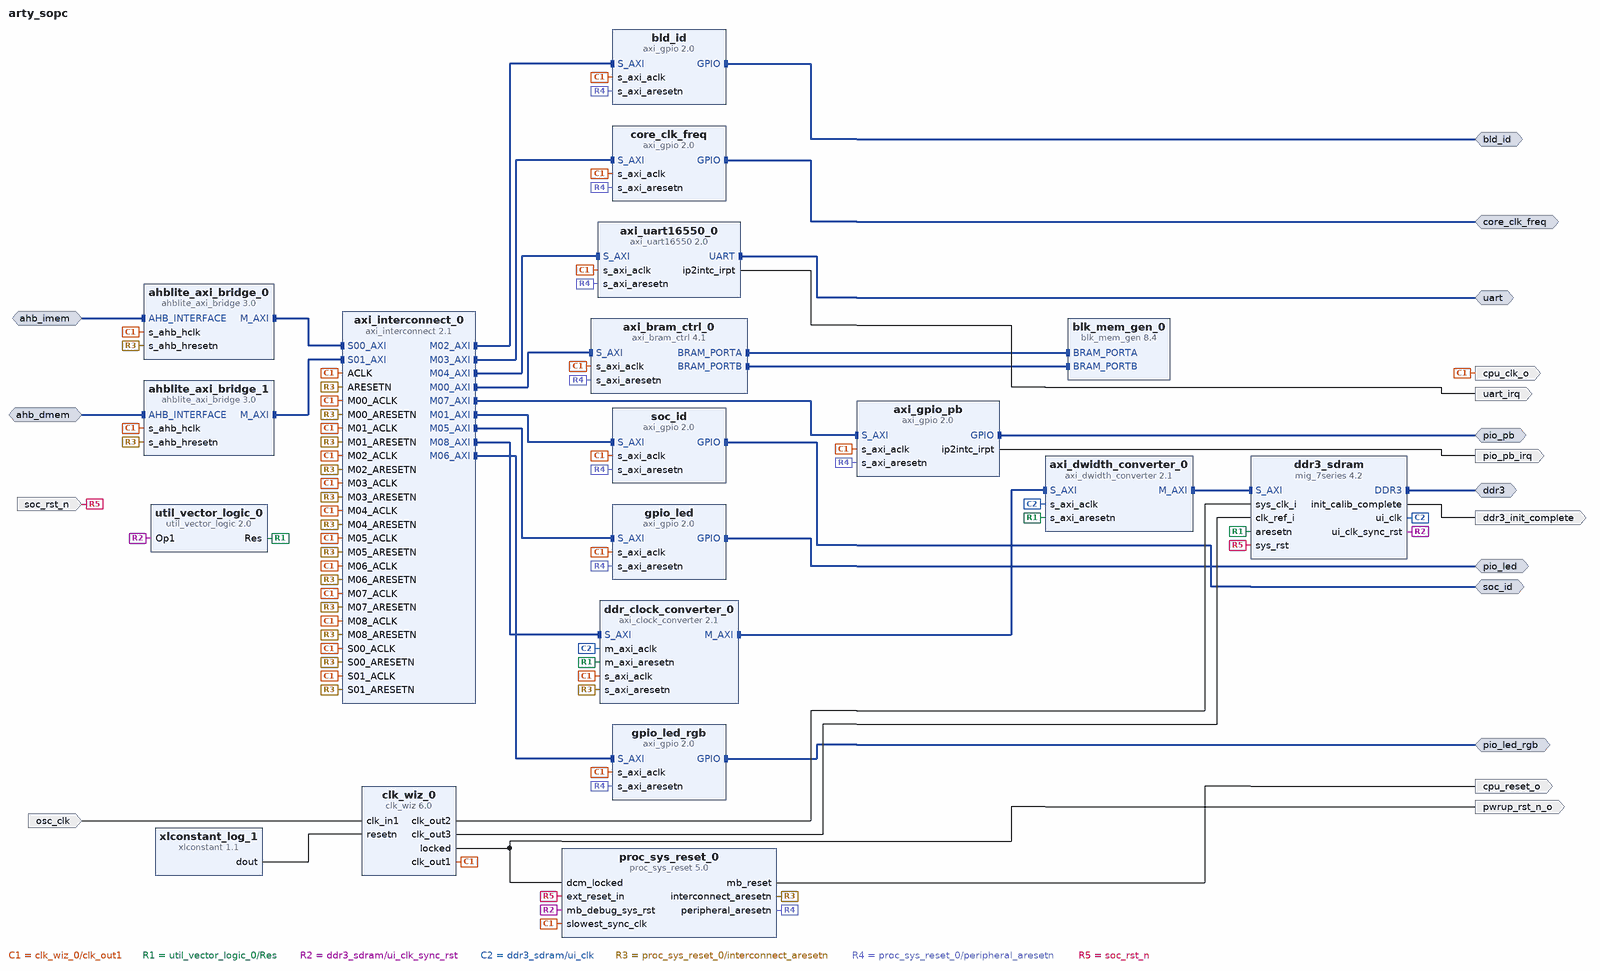
[diagram p0: block diagram of the top level]
# Vivado block design arty_sopc, xc7a100tcsg324-1, Vivado 2022.2
create_bd_design arty_sopc

create_bd_intf_port -mode Slave -vlnv xilinx.com:interface:ahblite_rtl:2.0 ahb_dmem
create_bd_intf_port -mode Slave -vlnv xilinx.com:interface:ahblite_rtl:2.0 ahb_imem
create_bd_intf_port -mode Master -vlnv xilinx.com:interface:gpio_rtl:1.0 bld_id
create_bd_intf_port -mode Master -vlnv xilinx.com:interface:gpio_rtl:1.0 core_clk_freq
create_bd_intf_port -mode Master -vlnv xilinx.com:interface:gpio_rtl:1.0 pio_led
create_bd_intf_port -mode Master -vlnv xilinx.com:interface:gpio_rtl:1.0 pio_led_rgb
create_bd_intf_port -mode Master -vlnv xilinx.com:interface:gpio_rtl:1.0 pio_pb
create_bd_intf_port -mode Master -vlnv xilinx.com:interface:ddrx_rtl:1.0 ddr3
create_bd_intf_port -mode Master -vlnv xilinx.com:interface:gpio_rtl:1.0 soc_id
create_bd_intf_port -mode Master -vlnv xilinx.com:interface:uart_rtl:1.0 uart
create_bd_port -dir O -type clk cpu_clk_o
create_bd_port -dir O -type rst cpu_reset_o
create_bd_port -dir O ddr3_init_complete
create_bd_port -dir I -type clk osc_clk
create_bd_port -dir O -type intr pio_pb_irq
create_bd_port -dir O -type rst pwrup_rst_n_o
create_bd_port -dir I -type rst soc_rst_n
create_bd_port -dir O -type intr uart_irq

create_bd_cell -type ip -vlnv xilinx.com:ip:ahblite_axi_bridge:3.0 ahblite_axi_bridge_0
set_property -dict {CONFIG.C_AHB_AXI_TIMEOUT 256} [get_bd_cells ahblite_axi_bridge_0]
create_bd_cell -type ip -vlnv xilinx.com:ip:ahblite_axi_bridge:3.0 ahblite_axi_bridge_1
set_property -dict {CONFIG.C_AHB_AXI_TIMEOUT 256 CONFIG.C_M_AXI_SUPPORTS_NARROW_BURST 1} [get_bd_cells ahblite_axi_bridge_1]
create_bd_cell -type ip -vlnv xilinx.com:ip:axi_bram_ctrl:4.1 axi_bram_ctrl_0
set_property -dict {CONFIG.PROTOCOL AXI4LITE CONFIG.SINGLE_PORT_BRAM 0} [get_bd_cells axi_bram_ctrl_0]
create_bd_cell -type ip -vlnv xilinx.com:ip:axi_dwidth_converter:2.1 axi_dwidth_converter_0
create_bd_cell -type ip -vlnv xilinx.com:ip:axi_gpio:2.0 axi_gpio_pb
set_property -dict [list \
  CONFIG.C_ALL_INPUTS 1 \
  CONFIG.C_GPIO_WIDTH 4 \
  CONFIG.C_INTERRUPT_PRESENT 1 \
  CONFIG.GPIO_BOARD_INTERFACE Custom \
] [get_bd_cells axi_gpio_pb]
create_bd_cell -type ip -vlnv xilinx.com:ip:axi_interconnect:2.1 axi_interconnect_0
set_property -dict [list \
  CONFIG.NUM_MI 9 \
  CONFIG.NUM_SI 2 \
  CONFIG.STRATEGY 1 \
  CONFIG.SYNCHRONIZATION_STAGES 2 \
] [get_bd_cells axi_interconnect_0]
create_bd_cell -type ip -vlnv xilinx.com:ip:axi_uart16550:2.0 axi_uart16550_0
set_property -dict {CONFIG.C_S_AXI_ACLK_FREQ_HZ 25000000} [get_bd_cells axi_uart16550_0]
create_bd_cell -type ip -vlnv xilinx.com:ip:axi_gpio:2.0 bld_id
set_property -dict {CONFIG.C_ALL_INPUTS 1 CONFIG.C_IS_DUAL 0} [get_bd_cells bld_id]
create_bd_cell -type ip -vlnv xilinx.com:ip:blk_mem_gen:8.4 blk_mem_gen_0
set_property -dict [list \
  CONFIG.EN_SAFETY_CKT false \
  CONFIG.Enable_B Use_ENB_Pin \
  CONFIG.Memory_Type True_Dual_Port_RAM \
  CONFIG.Port_B_Clock 100 \
  CONFIG.Port_B_Enable_Rate 100 \
  CONFIG.Port_B_Write_Rate 50 \
  CONFIG.Use_RSTB_Pin true \
] [get_bd_cells blk_mem_gen_0]
create_bd_cell -type ip -vlnv xilinx.com:ip:clk_wiz:6.0 clk_wiz_0
set_property -dict [list \
  CONFIG.CLKOUT1_JITTER 181.828 \
  CONFIG.CLKOUT1_PHASE_ERROR 104.359 \
  CONFIG.CLKOUT1_REQUESTED_OUT_FREQ 25.000 \
  CONFIG.CLKOUT2_REQUESTED_OUT_FREQ 166.667 \
  CONFIG.CLKOUT2_USED true \
  CONFIG.CLKOUT3_REQUESTED_OUT_FREQ 200.000 \
  CONFIG.CLKOUT3_USED true \
  CONFIG.ENABLE_CLOCK_MONITOR false \
  CONFIG.MMCM_DIVCLK_DIVIDE 1 \
  CONFIG.NUM_OUT_CLKS 3 \
  CONFIG.PRIMITIVE MMCM \
  CONFIG.RESET_PORT resetn \
  CONFIG.RESET_TYPE ACTIVE_LOW \
  CONFIG.USE_LOCKED true \
  CONFIG.USE_RESET true \
] [get_bd_cells clk_wiz_0]
create_bd_cell -type ip -vlnv xilinx.com:ip:axi_gpio:2.0 core_clk_freq
set_property -dict {CONFIG.C_ALL_INPUTS 1 CONFIG.C_IS_DUAL 0} [get_bd_cells core_clk_freq]
create_bd_cell -type ip -vlnv xilinx.com:ip:mig_7series:4.2 ddr3_sdram
set_property -dict {CONFIG.BOARD_MIG_PARAM ddr3_sdram} [get_bd_cells ddr3_sdram]
create_bd_cell -type ip -vlnv xilinx.com:ip:axi_clock_converter:2.1 ddr_clock_converter_0
create_bd_cell -type ip -vlnv xilinx.com:ip:axi_gpio:2.0 gpio_led
set_property -dict {CONFIG.C_ALL_OUTPUTS 1 CONFIG.C_GPIO_WIDTH 2 CONFIG.C_IS_DUAL 0} [get_bd_cells gpio_led]
create_bd_cell -type ip -vlnv xilinx.com:ip:axi_gpio:2.0 gpio_led_rgb
set_property -dict {CONFIG.C_ALL_OUTPUTS 1 CONFIG.C_GPIO_WIDTH 12} [get_bd_cells gpio_led_rgb]
create_bd_cell -type ip -vlnv xilinx.com:ip:proc_sys_reset:5.0 proc_sys_reset_0
create_bd_cell -type ip -vlnv xilinx.com:ip:axi_gpio:2.0 soc_id
set_property -dict {CONFIG.C_ALL_INPUTS 1 CONFIG.C_IS_DUAL 0} [get_bd_cells soc_id]
create_bd_cell -type ip -vlnv xilinx.com:ip:util_vector_logic:2.0 util_vector_logic_0
set_property -dict {CONFIG.C_OPERATION not CONFIG.C_SIZE 1} [get_bd_cells util_vector_logic_0]
create_bd_cell -type ip -vlnv xilinx.com:ip:xlconstant:1.1 xlconstant_log_1

# ---- connections ----

connect_bd_intf_net [get_bd_intf_ports ahb_imem] [get_bd_intf_pins ahblite_axi_bridge_0/AHB_INTERFACE]
connect_bd_intf_net [get_bd_intf_ports ahb_dmem] [get_bd_intf_pins ahblite_axi_bridge_1/AHB_INTERFACE]
connect_bd_intf_net [get_bd_intf_pins ahblite_axi_bridge_0/M_AXI] [get_bd_intf_pins axi_interconnect_0/S00_AXI]
connect_bd_intf_net [get_bd_intf_pins ahblite_axi_bridge_1/M_AXI] [get_bd_intf_pins axi_interconnect_0/S01_AXI]
connect_bd_intf_net [get_bd_intf_pins axi_bram_ctrl_0/BRAM_PORTA] [get_bd_intf_pins blk_mem_gen_0/BRAM_PORTA]
connect_bd_intf_net [get_bd_intf_pins axi_bram_ctrl_0/BRAM_PORTB] [get_bd_intf_pins blk_mem_gen_0/BRAM_PORTB]
connect_bd_intf_net [get_bd_intf_pins axi_dwidth_converter_0/M_AXI] [get_bd_intf_pins ddr3_sdram/S_AXI]
connect_bd_intf_net -intf_net axi_gpio_0_GPIO [get_bd_intf_ports soc_id] [get_bd_intf_pins soc_id/GPIO]
connect_bd_intf_net -intf_net axi_gpio_2_GPIO [get_bd_intf_ports pio_pb] [get_bd_intf_pins axi_gpio_pb/GPIO]
connect_bd_intf_net -intf_net axi_gpio_brd_sclkl_GPIO [get_bd_intf_ports core_clk_freq] [get_bd_intf_pins core_clk_freq/GPIO]
connect_bd_intf_net [get_bd_intf_pins axi_bram_ctrl_0/S_AXI] [get_bd_intf_pins axi_interconnect_0/M00_AXI]
connect_bd_intf_net [get_bd_intf_pins axi_interconnect_0/M01_AXI] [get_bd_intf_pins soc_id/S_AXI]
connect_bd_intf_net [get_bd_intf_pins axi_interconnect_0/M02_AXI] [get_bd_intf_pins bld_id/S_AXI]
connect_bd_intf_net [get_bd_intf_pins axi_interconnect_0/M03_AXI] [get_bd_intf_pins core_clk_freq/S_AXI]
connect_bd_intf_net [get_bd_intf_pins axi_interconnect_0/M04_AXI] [get_bd_intf_pins axi_uart16550_0/S_AXI]
connect_bd_intf_net [get_bd_intf_pins axi_interconnect_0/M05_AXI] [get_bd_intf_pins gpio_led/S_AXI]
connect_bd_intf_net [get_bd_intf_pins axi_interconnect_0/M06_AXI] [get_bd_intf_pins gpio_led_rgb/S_AXI]
connect_bd_intf_net [get_bd_intf_pins axi_gpio_pb/S_AXI] [get_bd_intf_pins axi_interconnect_0/M07_AXI]
connect_bd_intf_net [get_bd_intf_pins ddr_clock_converter_0/S_AXI] [get_bd_intf_pins axi_interconnect_0/M08_AXI]
connect_bd_intf_net [get_bd_intf_ports uart] [get_bd_intf_pins axi_uart16550_0/UART]
connect_bd_intf_net [get_bd_intf_ports bld_id] [get_bd_intf_pins bld_id/GPIO]
connect_bd_intf_net [get_bd_intf_pins axi_dwidth_converter_0/S_AXI] [get_bd_intf_pins ddr_clock_converter_0/M_AXI]
connect_bd_intf_net [get_bd_intf_ports pio_led] [get_bd_intf_pins gpio_led/GPIO]
connect_bd_intf_net [get_bd_intf_ports pio_led_rgb] [get_bd_intf_pins gpio_led_rgb/GPIO]
connect_bd_intf_net -intf_net mig_7series_0_DDR3 [get_bd_intf_ports ddr3] [get_bd_intf_pins ddr3_sdram/DDR3]
connect_bd_net -net axi_gpio_2_ip2intc_irpt [get_bd_pins axi_gpio_pb/ip2intc_irpt] [get_bd_ports pio_pb_irq]
connect_bd_net [get_bd_pins axi_uart16550_0/ip2intc_irpt] [get_bd_ports uart_irq]
connect_bd_net -net clk_in1_0_1 [get_bd_ports osc_clk] [get_bd_pins clk_wiz_0/clk_in1]
connect_bd_net [get_bd_pins clk_wiz_0/clk_out1] \
  [get_bd_pins ddr_clock_converter_0/s_axi_aclk] [get_bd_ports cpu_clk_o] [get_bd_pins ahblite_axi_bridge_0/s_ahb_hclk] \
  [get_bd_pins ahblite_axi_bridge_1/s_ahb_hclk] [get_bd_pins axi_bram_ctrl_0/s_axi_aclk] [get_bd_pins axi_gpio_pb/s_axi_aclk] \
  [get_bd_pins axi_interconnect_0/ACLK] [get_bd_pins axi_interconnect_0/M00_ACLK] [get_bd_pins axi_interconnect_0/M01_ACLK] \
  [get_bd_pins axi_interconnect_0/M02_ACLK] [get_bd_pins axi_interconnect_0/M03_ACLK] \
  [get_bd_pins axi_interconnect_0/M04_ACLK] [get_bd_pins axi_interconnect_0/M05_ACLK] \
  [get_bd_pins axi_interconnect_0/M06_ACLK] [get_bd_pins axi_interconnect_0/M07_ACLK] \
  [get_bd_pins axi_interconnect_0/M08_ACLK] [get_bd_pins axi_interconnect_0/S00_ACLK] \
  [get_bd_pins axi_interconnect_0/S01_ACLK] [get_bd_pins axi_uart16550_0/s_axi_aclk] [get_bd_pins bld_id/s_axi_aclk] \
  [get_bd_pins core_clk_freq/s_axi_aclk] [get_bd_pins gpio_led/s_axi_aclk] [get_bd_pins gpio_led_rgb/s_axi_aclk] \
  [get_bd_pins proc_sys_reset_0/slowest_sync_clk] [get_bd_pins soc_id/s_axi_aclk]
connect_bd_net [get_bd_pins clk_wiz_0/clk_out2] [get_bd_pins ddr3_sdram/sys_clk_i]
connect_bd_net [get_bd_pins clk_wiz_0/clk_out3] [get_bd_pins ddr3_sdram/clk_ref_i]
connect_bd_net [get_bd_pins clk_wiz_0/locked] [get_bd_ports pwrup_rst_n_o] [get_bd_pins proc_sys_reset_0/dcm_locked]
connect_bd_net -net ddr_rstn_interconnect_aresetn [get_bd_pins util_vector_logic_0/Res] \
  [get_bd_pins axi_dwidth_converter_0/s_axi_aresetn] [get_bd_pins ddr3_sdram/aresetn] \
  [get_bd_pins ddr_clock_converter_0/m_axi_aresetn]
connect_bd_net -net mig_7series_0_init_calib_complete [get_bd_pins ddr3_sdram/init_calib_complete] [get_bd_ports ddr3_init_complete]
connect_bd_net -net mig_7series_0_ui_clk_sync_rst [get_bd_pins ddr3_sdram/ui_clk_sync_rst] \
  [get_bd_pins proc_sys_reset_0/mb_debug_sys_rst] [get_bd_pins util_vector_logic_0/Op1]
connect_bd_net -net mig_7series_1_ui_clk [get_bd_pins ddr3_sdram/ui_clk] \
  [get_bd_pins axi_dwidth_converter_0/s_axi_aclk] [get_bd_pins ddr_clock_converter_0/m_axi_aclk]
connect_bd_net [get_bd_pins proc_sys_reset_0/interconnect_aresetn] \
  [get_bd_pins ddr_clock_converter_0/s_axi_aresetn] [get_bd_pins ahblite_axi_bridge_0/s_ahb_hresetn] \
  [get_bd_pins ahblite_axi_bridge_1/s_ahb_hresetn] [get_bd_pins axi_interconnect_0/ARESETN] \
  [get_bd_pins axi_interconnect_0/M00_ARESETN] [get_bd_pins axi_interconnect_0/M01_ARESETN] \
  [get_bd_pins axi_interconnect_0/M02_ARESETN] [get_bd_pins axi_interconnect_0/M03_ARESETN] \
  [get_bd_pins axi_interconnect_0/M04_ARESETN] [get_bd_pins axi_interconnect_0/M05_ARESETN] \
  [get_bd_pins axi_interconnect_0/M06_ARESETN] [get_bd_pins axi_interconnect_0/M07_ARESETN] \
  [get_bd_pins axi_interconnect_0/M08_ARESETN] [get_bd_pins axi_interconnect_0/S00_ARESETN] \
  [get_bd_pins axi_interconnect_0/S01_ARESETN]
connect_bd_net [get_bd_pins proc_sys_reset_0/mb_reset] [get_bd_ports cpu_reset_o]
connect_bd_net [get_bd_pins proc_sys_reset_0/peripheral_aresetn] \
  [get_bd_pins axi_bram_ctrl_0/s_axi_aresetn] [get_bd_pins axi_gpio_pb/s_axi_aresetn] \
  [get_bd_pins axi_uart16550_0/s_axi_aresetn] [get_bd_pins bld_id/s_axi_aresetn] [get_bd_pins core_clk_freq/s_axi_aresetn] \
  [get_bd_pins gpio_led/s_axi_aresetn] [get_bd_pins gpio_led_rgb/s_axi_aresetn] [get_bd_pins soc_id/s_axi_aresetn]
connect_bd_net [get_bd_ports soc_rst_n] [get_bd_pins ddr3_sdram/sys_rst] [get_bd_pins proc_sys_reset_0/ext_reset_in]
connect_bd_net [get_bd_pins xlconstant_log_1/dout] [get_bd_pins clk_wiz_0/resetn]

# ---- address map ----
assign_bd_address -offset 0x00000000 -range 256M -target_address_space [get_bd_addr_spaces ahb_dmem] [get_bd_addr_segs ddr3_sdram/memmap/memaddr]
assign_bd_address -offset 0xFF000000 -range 4K -target_address_space [get_bd_addr_spaces ahb_dmem] [get_bd_addr_segs soc_id/S_AXI/Reg]
assign_bd_address -offset 0xFF001000 -range 4K -target_address_space [get_bd_addr_spaces ahb_dmem] [get_bd_addr_segs bld_id/S_AXI/Reg]
assign_bd_address -offset 0xFF002000 -range 4K -target_address_space [get_bd_addr_spaces ahb_dmem] [get_bd_addr_segs core_clk_freq/S_AXI/Reg]
assign_bd_address -offset 0xFF010000 -range 4K -target_address_space [get_bd_addr_spaces ahb_dmem] [get_bd_addr_segs axi_uart16550_0/S_AXI/Reg]
assign_bd_address -offset 0xFF020000 -range 4K -target_address_space [get_bd_addr_spaces ahb_dmem] [get_bd_addr_segs gpio_led/S_AXI/Reg]
assign_bd_address -offset 0xFF021000 -range 4K -target_address_space [get_bd_addr_spaces ahb_dmem] [get_bd_addr_segs gpio_led_rgb/S_AXI/Reg]
assign_bd_address -offset 0xFF028000 -range 4K -target_address_space [get_bd_addr_spaces ahb_dmem] [get_bd_addr_segs axi_gpio_pb/S_AXI/Reg]
assign_bd_address -offset 0xFFFF0000 -range 64K -target_address_space [get_bd_addr_spaces ahb_dmem] [get_bd_addr_segs axi_bram_ctrl_0/S_AXI/Mem0]
assign_bd_address -offset 0x00000000 -range 256M -target_address_space [get_bd_addr_spaces ahb_imem] [get_bd_addr_segs ddr3_sdram/memmap/memaddr]
assign_bd_address -offset 0xFFFF0000 -range 64K -target_address_space [get_bd_addr_spaces ahb_imem] [get_bd_addr_segs axi_bram_ctrl_0/S_AXI/Mem0]
exclude_bd_addr_seg -offset 0xFF000000 -range 4K -target_address_space [get_bd_addr_spaces ahb_imem] [get_bd_addr_segs soc_id/S_AXI/Reg]
exclude_bd_addr_seg -offset 0xFF001000 -range 4K -target_address_space [get_bd_addr_spaces ahb_imem] [get_bd_addr_segs bld_id/S_AXI/Reg]
exclude_bd_addr_seg -offset 0xFF002000 -range 4K -target_address_space [get_bd_addr_spaces ahb_imem] [get_bd_addr_segs core_clk_freq/S_AXI/Reg]
exclude_bd_addr_seg -offset 0xFF010000 -range 4K -target_address_space [get_bd_addr_spaces ahb_imem] [get_bd_addr_segs axi_uart16550_0/S_AXI/Reg]
exclude_bd_addr_seg -offset 0xFF020000 -range 4K -target_address_space [get_bd_addr_spaces ahb_imem] [get_bd_addr_segs gpio_led/S_AXI/Reg]
exclude_bd_addr_seg -offset 0xFF021000 -range 4K -target_address_space [get_bd_addr_spaces ahb_imem] [get_bd_addr_segs gpio_led_rgb/S_AXI/Reg]
exclude_bd_addr_seg -offset 0xFF028000 -range 4K -target_address_space [get_bd_addr_spaces ahb_imem] [get_bd_addr_segs axi_gpio_pb/S_AXI/Reg]

validate_bd_design
save_bd_design
